# Altium schematic sheet [01] VS1053.SchDoc
size A4
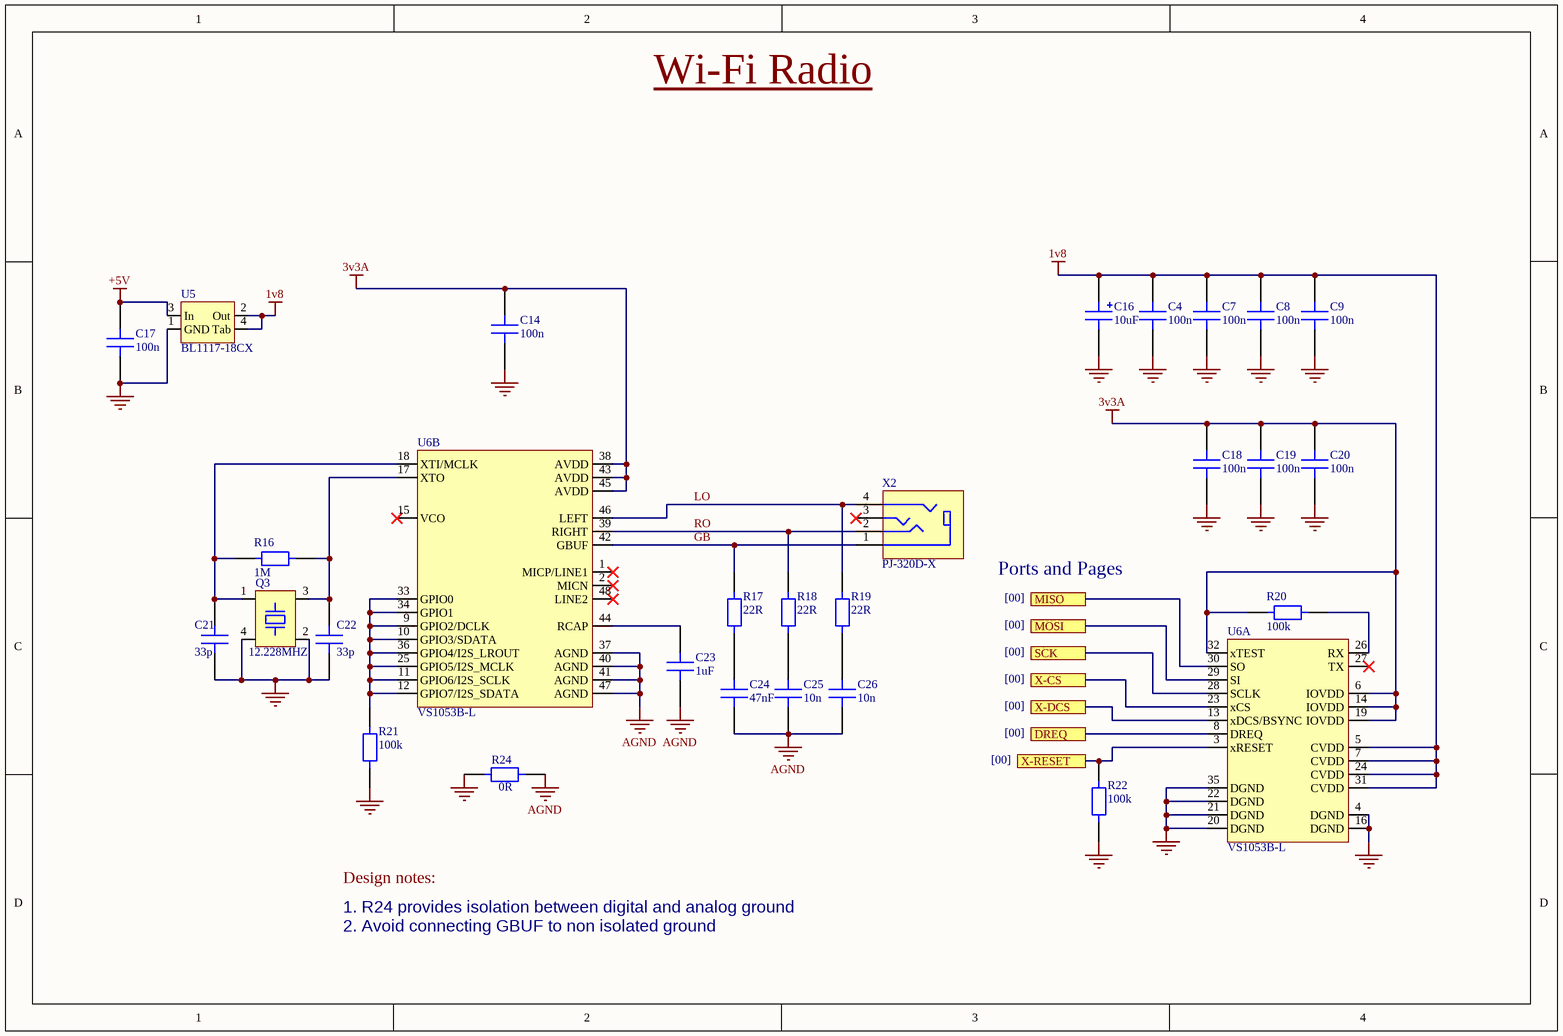
[diagram p0: [01] VS1053.SchDoc]

## Parts
C4  100n  [0603 CAP]
C7  100n  [0603 CAP]
C8  100n  [0603 CAP]
C9  100n  [0603 CAP]
C14  100n  [0603 CAP]
C16  10uF  [CAP 1206]
C17  100n  [0603 CAP]
C18  100n  [0603 CAP]
C19  100n  [0603 CAP]
C20  100n  [0603 CAP]
C21  33p  [0603 CAP]
C22  33p  [0603 CAP]
C23  1uF  [0603 CAP]
C24  47nF  [0603 CAP]
C25  10n  [0603 CAP]
C26  10n  [0603 CAP]
Q3  12.228MHZ  [ABM8W]
R16  1M  [0603 RES]
R17  22R  [0603 RES]
R18  22R  [0603 RES]
R19  22R  [0603 RES]
R20  100k  [0603 RES]
R21  100k  [0603 RES]
R22  100k  [0603 RES]
R24  0R  [0603 RES]
U5  BL1117-18CX  [SOT233-3]
U6  VS1053B-L  [LQFP-48]  (parts A,B of 2)
X2  PJ-320D-X  [3.5mm Jack]

## Ports
DREQ, MISO, MOSI, SCK, X-CS, X-DCS, X-RESET

## Nets
1v8: C4.2 C7.2 C8.2 C9.2 C16.1 U5.2(Out) U5.4(Tab) U6.5(CVDD) U6.7(CVDD) U6.24(CVDD) U6.31(CVDD)
3v3A: C14.2 C18.2 C19.2 C20.2 R20.2 U6.6(IOVDD) U6.14(IOVDD) U6.19(IOVDD) U6.32(xTEST) U6.38(AVDD) U6.43(AVDD) U6.45(AVDD)
+5V: C17.2 U5.3(In)
AGND: C23.1 C24.1 C25.1 C26.1 R24.2 U6.37(AGND) U6.40(AGND) U6.41(AGND) U6.47(AGND)
GND: C4.1 C7.1 C8.1 C9.1 C14.1 C16.2 C17.1 C18.1 C19.1 C20.1 C21.1 C22.1 Q3.2(GND) Q3.4(GND) R21.1 R22.1 R24.1 U5.1(GND) U6.4(DGND) U6.16(DGND) U6.20(DGND) U6.21(DGND) U6.22(DGND) U6.35(DGND)
DREQ: U6.8(DREQ) ; port DREQ
GB: R17.2 U6.42(GBUF) X2.1
LO: R19.2 U6.46(LEFT) X2.4
MISO: U6.30(SO) ; port MISO
MOSI: U6.29(SI) ; port MOSI
RO: R18.2 U6.39(RIGHT) X2.2
SCK: U6.28(SCLK) ; port SCK
X-CS: U6.23(xCS) ; port X-CS
X-DCS: U6.13(xDCS/BSYNC) ; port X-DCS
X-RESET: R22.2 U6.3(xRESET) ; port X-RESET
NetC21_2: C21.2 Q3.1 R16.1 U6.18(XTI/MCLK)
NetC22_2: C22.2 Q3.3 R16.2 U6.17(XTO)
NetC23_2: C23.2 U6.44(RCAP)
NetC24_2: C24.2 R17.1
NetC25_2: C25.2 R18.1
NetC26_2: C26.2 R19.1
NetR20_1: R20.1 U6.26(RX)
NetR21_2: R21.2 U6.9(GPIO2/DCLK) U6.10(GPIO3/SDATA) U6.11(GPIO6/I2S_SCLK) U6.12(GPIO7/I2S_SDATA) U6.25(GPIO5/I2S_MCLK) U6.33(GPIO0) U6.34(GPIO1) U6.36(GPIO4/I2S_LROUT)

Not connected (* = marked no-connect by the designer): U6 1(MICP/LINE1)* 2(MICN)* 15(VCO)* 27(TX)* 48(LINE2)*; X2 3*

## Notes on the sheet
- Wi-Fi Radio
- Power
- VS1053B MP3 Decoder
- Ports and Pages
- [00]
- Design notes:
- 1. R24 provides isolation between digital and analog ground
  2. Avoid connecting GBUF to non isolated ground

## Library data of the parts
C4 C7-C9 C14 C17-C20 = CC0603KRX7R9BB104: MULTILAYER CERAMIC CAPACITORS MLCC - SMD/SMT 100NF 50V 0603 ROHS; Manufacturer: YAGEO; Category: Capacitors; MFR.Part #: CC0603KRX7R9BB104; LCSC Part #: C14663; Package: 0603; Datasheet: https://datasheet.lcsc.com/szlcsc/YAGEO-CC0603KRX7R9BB104_C14663.pdf
C16 = TAJA106K016RNJ: TANTALUM CAPACITORS 10UF 16V CASE-A_3216 ROHS; Manufacturer: AVX; Category: Capacitors; MFR.Part #: TAJA106K016RNJ; LCSC Part #: C7171; Package: CASE-A_3216; Datasheet: https://datasheet.lcsc.com/szlcsc/AVX-TAJA106K016RNJ_C7171.pdf
C21 C22 = CL10C330JB8NNNC: MULTILAYER CERAMIC CAPACITORS MLCC - SMD/SMT 33PF 50V 0603 ROHS; Manufacturer: Samsung Electro-Mechanics; Category: Capacitors; MFR.Part #: CL10C330JB8NNNC; LCSC Part #: C1663; Package: 0603; Datasheet: https://datasheet.lcsc.com/szlcsc/Samsung-Electro-Mechanics-CL10C330JB8NNNC_C1663.pdf
C23 = CL10A105KB8NNNC: MULTILAYER CERAMIC CAPACITORS MLCC - SMD/SMT 1UF 50V 0603 ROHS; Manufacturer: Samsung Electro-Mechanics; Category: Capacitors; MFR.Part #: CL10A105KB8NNNC; LCSC Part #: C15849; Package: 0603; Datasheet: https://datasheet.lcsc.com/szlcsc/Samsung-Electro-Mechanics-CL10A105KB8NNNC_C15849.pdf
C24 = CL10B473KB8NNNC: MULTILAYER CERAMIC CAPACITORS MLCC - SMD/SMT 47NF 50V 0603 ROHS; Manufacturer: Samsung Electro-Mechanics; Category: Capacitors; MFR.Part #: CL10B473KB8NNNC; LCSC Part #: C1622; Package: 0603; Datasheet: https://datasheet.lcsc.com/szlcsc/Samsung-Electro-Mechanics-CL10B473KB8NNNC_C1622.pdf
C25 C26 = 0603B103K500NT: MULTILAYER CERAMIC CAPACITORS MLCC - SMD/SMT 10NF 50V 0603 ROHS; Manufacturer: Guangdong Fenghua Advanced Tech; Category: Capacitors; MFR.Part #: 0603B103K500NT; LCSC Part #: C57112; Package: 0603; Datasheet: https://datasheet.lcsc.com/szlcsc/Guangdong-Fenghua-Advanced-Tech-0603B103K500NT_C57112.pdf
Q3 = X322512288MOB4SC: SMD CRYSTAL RESONATORS 12.288MHZ ±10PPM SMD-3225_4P ROHS; Manufacturer: Yangxing Tech; Category: Crystals; MFR.Part #: X322512288MOB4SC; LCSC Part #: C70567; Package: SMD-3225_4P; Datasheet: https://datasheet.lcsc.com/szlcsc/LCSC-X322512288MOB4SC_C70567.pdf
R16 = 0603WAF1004T5E: CHIP RESISTOR - SURFACE MOUNT 1MOHMS ±1% 1/10W 0603 ROHS; Manufacturer: Uniroyal Elec; Category: Resistors; MFR.Part #: 0603WAF1004T5E; LCSC Part #: C22935; Package: 0603; Datasheet: https://datasheet.lcsc.com/szlcsc/Uniroyal-Elec-0603WAF1004T5E_C22935.pdf
R17-R19 = 0603WAF220JT5E: CHIP RESISTOR - SURFACE MOUNT 22OHMS ±1% 1/10W 0603 ROHS; Manufacturer: Uniroyal Elec; Category: Resistors; MFR.Part #: 0603WAF220JT5E; LCSC Part #: C23345; Package: 0603; Datasheet: https://datasheet.lcsc.com/szlcsc/Uniroyal-Elec-0603WAF220JT5E_C23345.pdf
R20-R22 = 0603WAF1003T5E: CHIP RESISTOR - SURFACE MOUNT 100KOHMS ±1% 1/10W 0603 ROHS; Manufacturer: Uniroyal Elec; Category: Resistors; MFR.Part #: 0603WAF1003T5E; LCSC Part #: C25803; Package: 0603; Datasheet: https://datasheet.lcsc.com/szlcsc/Uniroyal-Elec-0603WAF1003T5E_C25803.pdf
R24 = 0603WAF0000T5E: CHIP RESISTOR - SURFACE MOUNT 0OHMS ±1% 1/10W 0603 ROHS; Manufacturer: Uniroyal Elec; Category: Resistors; MFR.Part #: 0603WAF0000T5E; LCSC Part #: C21189; Package: 0603; Datasheet: https://datasheet.lcsc.com/szlcsc/Uniroyal-Elec-0603WAF0000T5E_C21189.pdf
U5 = BL1117-18CX: LOW DROPOUT REGULATORS(LDO) POSITIVE FIXED 1.5V @ 1A 12V 1.8V 1A SOT-223 ROHS; Manufacturer: Shanghai Belling; Library Type: Extended; Category: IC's; MFR.Part #: BL1117-18CX; LCSC Part #: C78971; Package: SOT-223; Datasheet: https://datasheet.lcsc.com/szlcsc/Shanghai-Belling-BL1117-18CX_C78971.pdf
U6 = VS1053B-L: VIDEO-AUDIO INTERFACE ICS LQFP-48_7X7X05P ROHS; Manufacturer: VLSI Solution; Library Type: Extended; Category: IC's; MFR.Part #: VS1053B-L; LCSC Part #: C9922; Package: LQFP-48_7.0x7.0x0.5P; Datasheet: https://datasheet.lcsc.com/szlcsc/VLSI-Solution-VS1053B_C9922.pdf
X2 = PJ-320D-X: 3.5mm SMD Headphone Holder 4 Female Horizontal SMD Audio & Video Connectors RoHS; Manufacturer: XKB Enterprise; Category: Connectors; MFR.Part #: PJ-320D-X; LCSC Part #: C319111; Package: SMD; Datasheet: https://datasheet.lcsc.com/szlcsc/1810301445_XKB-Enterprise-PJ-320D-X_C319111.pdf; ComponentLink1Description: PJ-320D-X; ComponentLink1URL: https://datasheet.lcsc.com/szlcsc/1810301445_XKB-Enterprise-PJ-320D-X_C319111.pdf